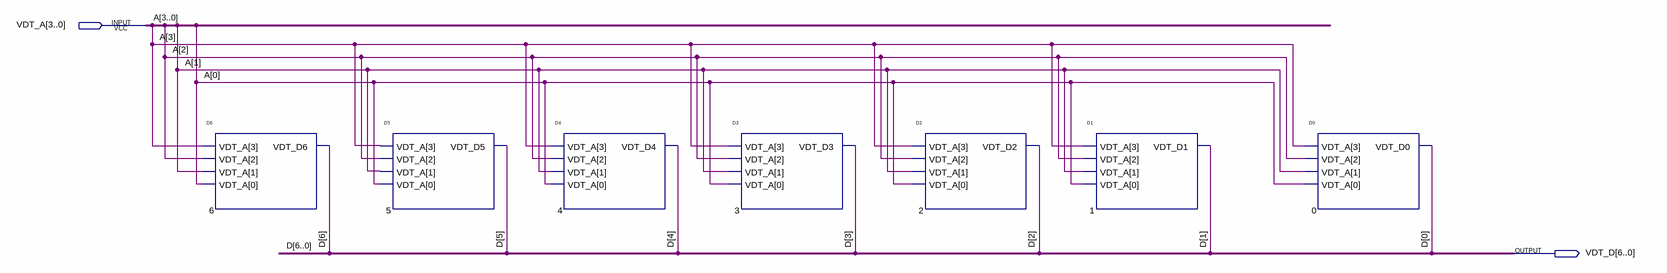
[diagram p0: schematic sheet]
// Quartus schematic Assignment4.bdf as structural Verilog: 7 symbols, 2 pins
module Assignment4 (
  input  [3:0] VDT_A,
  output [6:0] VDT_D
);

  D6 u_6 (.VDT_A(VDT_A), .VDT_D6(VDT_D[6]));
  D5 u_5 (.VDT_A(VDT_A), .VDT_D5(VDT_D[5]));
  D4 u_4 (.VDT_A(VDT_A), .VDT_D4(VDT_D[4]));
  D3 u_3 (.VDT_A(VDT_A), .VDT_D3(VDT_D[3]));
  D2 u_2 (.VDT_A(VDT_A), .VDT_D2(VDT_D[2]));
  D1 u_1 (.VDT_A(VDT_A), .VDT_D1(VDT_D[1]));
  D0 u_0 (.VDT_A(VDT_A), .VDT_D0(VDT_D[0]));

  // Other names for the same wires on the sheet: D[6:0] = VDT_D; A[3:0] = VDT_A
endmodule
